# EAGLE design ztsh_autoguide (EAGLE 7.2.0)
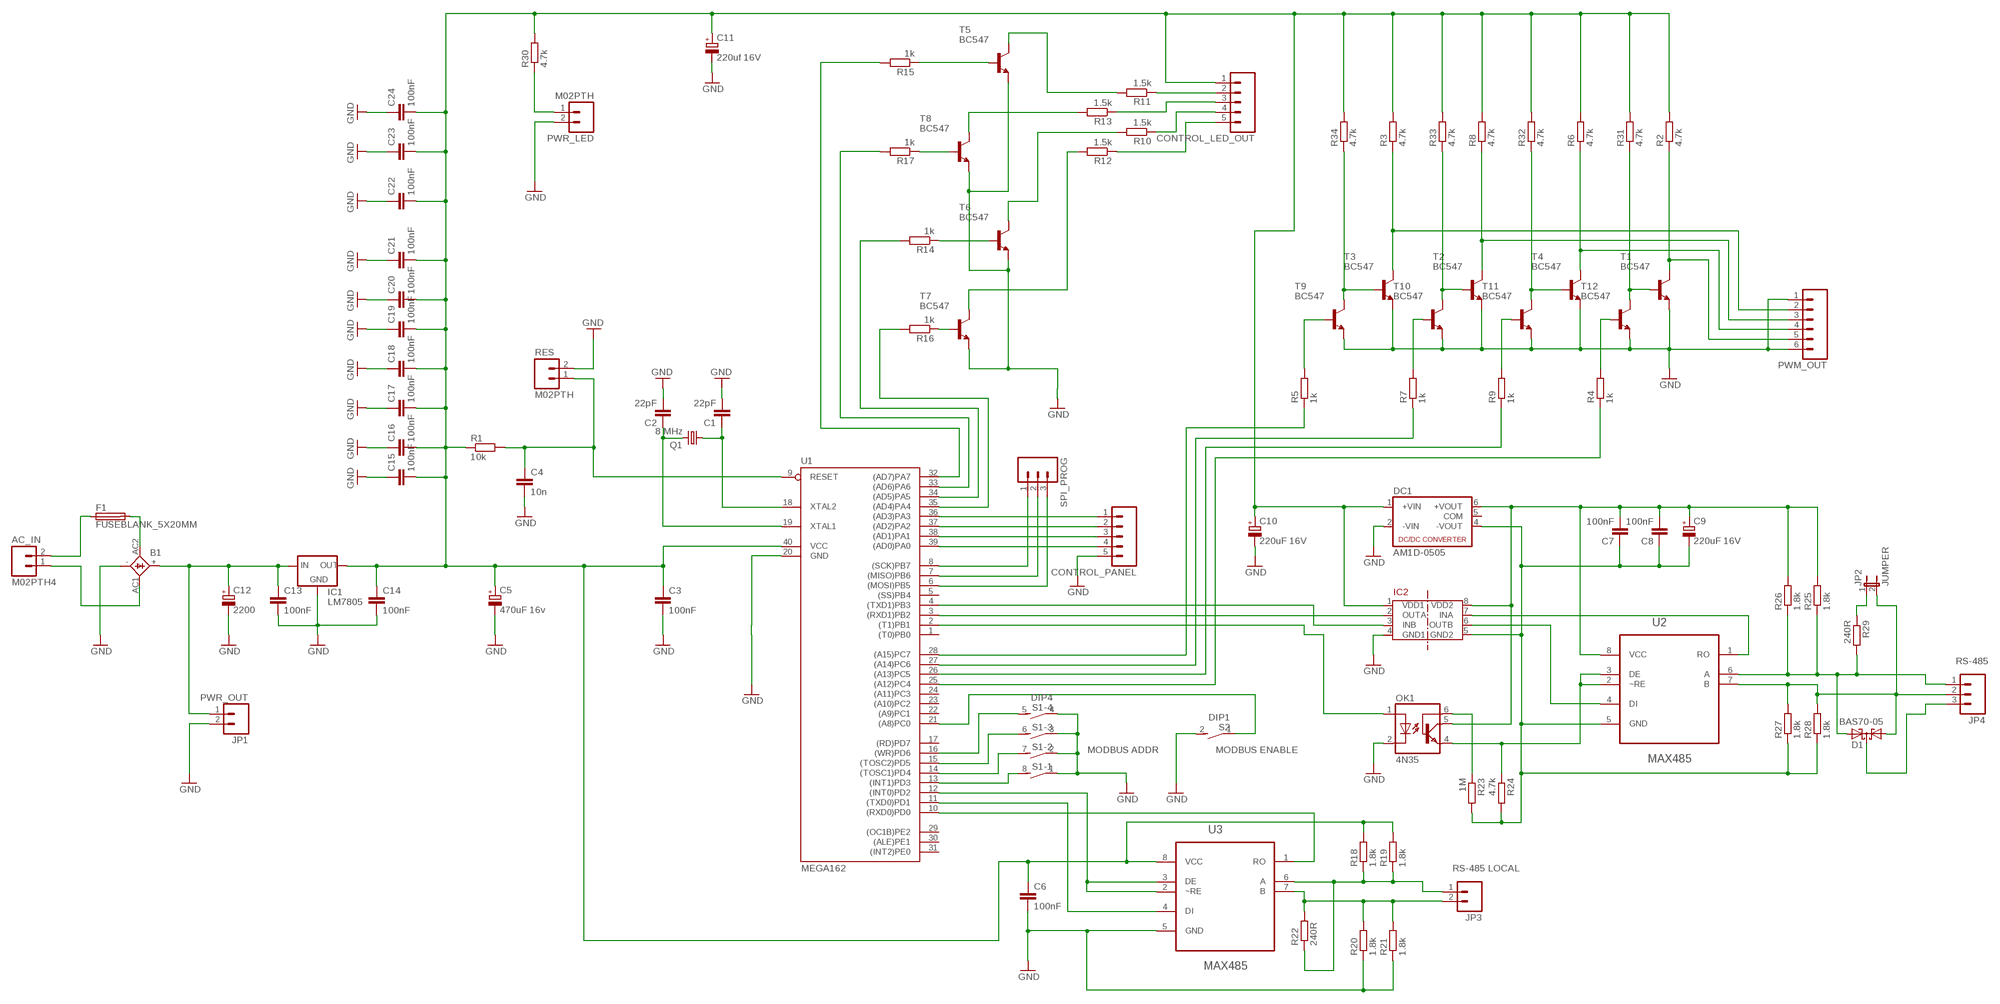
[diagram p0: schematic, sheet 1]

## Parts
AC_IN  M02PTH4  [1X02_XTRA_BIG]
B1  KBL  [KBL]
C1  22pF  C-EU025-024X044  [C025-024X044]
C2  22pF  C-EU025-024X044  [C025-024X044]
C3  100nF  C-EUC0805  [C0805]
C4  10n  C-EUC0805  [C0805]
C5  470uF 16v  CPOL-EUE2-5  [E2-5]
C6  100nF  C-EUC0805  [C0805]
C7  100nF  C-EUC0805  [C0805]
C8  100nF  C-EUC0805  [C0805]
C9  220uF 16V  CPOL-EUE2-5  [E2-5]
C10  220uF 16V  CPOL-EUE2-5  [E2-5]
C11  220uf 16V  CPOL-EUE2-5  [E2-5]
C12  2200  CPOL-EUE3.5-10  [E3,5-10]
C13  100nF  C-EUC0805  [C0805]
C14  100nF  C-EUC0805  [C0805]
C15  100nF  C-EUC0805  [C0805]
C16  100nF  C-EUC0805  [C0805]
C17  100nF  C-EUC0805  [C0805]
C18  100nF  C-EUC0805  [C0805]
C19  100nF  C-EUC0805  [C0805]
C20  100nF  C-EUC0805  [C0805]
C21  100nF  C-EUC0805  [C0805]
C22  100nF  C-EUC0805  [C0805]
C23  100nF  C-EUC0805  [C0805]
C24  100nF  C-EUC0805  [C0805]
CONTROL_LED_OUT  M05LOCK  [1X05_LOCK]
CONTROL_PANEL  M05LOCK  [1X05_LOCK]
D1  BAS70-05  [SOT23]
DC1  AM1D-0505  NMA  [NMA]
F1  FUSEBLANK_5X20MM  [FUSE_HOLDER_5X20MM]
IC1  LM7805  V_REG_78XX-TO-220  [TO-220-ALT]
IC2  ADUM1201  [SO8]
JP1  PWR_OUT  M02LOCK_LONGPADS  [1X02_LOCK_LONGPADS]
JP2  JUMPER  JP1E  [JP1]
JP3  M02JST-PTH-VERT  [JST-2-PTH-VERT]
JP4  M03JST-PTH-VERT  [JST-3-PTH-VERT]
OK1  4N35  [DIL06]
PWM_OUT  M06LOCK  [1X06_LOCK]
PWR_LED  M02PTH  [1X02]
Q1  8 MHz  CRYSTALHC18U-V  [HC18U-V]
R1  10k  R-EU_0207/10  [0207/10]
R2  4.7k  R-EU_0204/7  [0204/7]
R3  4.7k  R-EU_0204/7  [0204/7]
R4  1k  R-EU_0204/7  [0204/7]
R5  1k  R-EU_0204/7  [0204/7]
R6  4.7k  R-EU_0204/7  [0204/7]
R7  1k  R-EU_0204/7  [0204/7]
R8  4.7k  R-EU_0204/7  [0204/7]
R9  1k  R-EU_0204/7  [0204/7]
R10  1.5k  R-EU_0204/7  [0204/7]
R11  1.5k  R-EU_0204/7  [0204/7]
R12  1.5k  R-EU_0204/7  [0204/7]
R13  1.5k  R-EU_0204/7  [0204/7]
R14  1k  R-EU_0204/7  [0204/7]
R15  1k  R-EU_0204/7  [0204/7]
R16  1k  R-EU_0204/7  [0204/7]
R17  1k  R-EU_0204/7  [0204/7]
R18  1.8k  R-EU_R0805  [R0805]
R19  1.8k  R-EU_R0805  [R0805]
R20  1.8k  R-EU_R0805  [R0805]
R21  1.8k  R-EU_R0805  [R0805]
R22  240R  R-EU_R0805  [R0805]
R23  1M  R-EU_0204/7  [0204/7]
R24  4.7k  R-EU_0204/7  [0204/7]
R25  1.8k  R-EU_R0805  [R0805]
R26  1.8k  R-EU_R0805  [R0805]
R27  1.8k  R-EU_R0805  [R0805]
R28  1.8k  R-EU_R0805  [R0805]
R29  240R  R-EU_R0805  [R0805]
R30  4.7k  R-EU_0207/10  [0207/10]
R31  4.7k  R-EU_0204/7  [0204/7]
R32  4.7k  R-EU_0204/7  [0204/7]
R33  4.7k  R-EU_0204/7  [0204/7]
R34  4.7k  R-EU_0204/7  [0204/7]
RES  M02PTH  [1X02]
S1  DIP4  DIP04S  [DIP04S]
S2  DIP1  DS01E  [DS-01]
SPI_PROG  M03LOCK  [1X03_LOCK]
T1  BC547  [TO92]
T2  BC547  [TO92]
T3  BC547  [TO92]
T4  BC547  [TO92]
T5  BC547  [TO92]
T6  BC547  [TO92]
T7  BC547  [TO92]
T8  BC547  [TO92]
T9  BC547  [TO92]
T10  BC547  [TO92]
T11  BC547  [TO92]
T12  BC547  [TO92]
U1  MEGA162  MEGA162PV-*P*  [DIL40]
U2  MAX485  MAX485CSA+  [SOIC127P600X175-8N]
U3  MAX485  MAX485CSA+  [SOIC127P600X175-8N]

## Nets
GND: B1.- C1.2 C2.2 C3.2 C4.2 C5.- C6.2 C10.- C11.- C12.- C13.2 C14.2 C15.1 C16.1 C17.1 C18.1 C19.1 C20.1 C21.1 C22.1 C23.1 C24.1 CONTROL_PANEL.5 DC1.2(-VIN) IC1.GND IC2.4(GND1) JP1.2 OK1.2(C) PWM_OUT.1 PWM_OUT.6 PWR_LED.2 R20.1 R21.1 RES.2 S1.1 S1.2 S1.3 S1.4 S2.2 T1.1(E) T2.1(E) T3.1(E) T4.1(E) T5.1(E) T6.1(E) T7.1(E) T8.1(E) T9.1(E) T10.1(E) T11.1(E) T12.1(E) U1.20(GND) U3.5(GND)
GND_ISOL: C7.1 C8.1 C9.- DC1.4(-VOUT) IC2.5(GND2) R23.2 R24.2 R27.1 R28.1 U2.5(GND)
N$1: C2.1 Q1.2 U1.19(XTAL1)
N$2: C1.1 Q1.1 U1.18(XTAL2)
N$3: C4.1 R1.2 RES.1 U1.9(RESET)
N$4: U1.11((TXD0)PD1) U3.4(DI)
N$5: U1.12((INT0)PD2) U3.2(~RE) U3.3(DE)
N$6: U1.10((RXD0)PD0) U3.1(RO)
N$7: R7.2 T10.2(B)
N$8: R15.2 U1.32((AD7)PA7)
N$9: JP3.1 R18.1 R19.1 R22.1 U3.6(A)
N$10: JP3.2 R20.2 R21.2 R22.2 U3.7(B)
N$11: R17.2 U1.33((AD6)PA6)
N$12: R14.2 U1.34((AD5)PA5)
N$13: R16.1 T7.2(B)
N$14: R16.2 U1.35((AD4)PA4)
N$15: B1.+ C12.+ C13.1 IC1.IN JP1.1
N$16: AC_IN.1 B1.AC1(AC2)
N$17: AC_IN.2 F1.1
N$18: IC2.2(OUTA) U1.3((RXD1)PB2)
N$19: R14.1 T6.2(B)
N$20: CONTROL_LED_OUT.2 R11.1
N$21: CONTROL_LED_OUT.3 R13.1
N$22: CONTROL_LED_OUT.4 R10.1
N$23: CONTROL_LED_OUT.5 R12.1
N$24: R11.2 T5.3(C)
N$25: R13.2 T8.3(C)
N$26: R10.2 T6.3(C)
N$27: R12.2 T7.3(C)
N$28: R17.1 T8.2(B)
N$29: R15.1 T5.2(B)
N$30: B1.AC2(AC1) F1.2
N$31: IC2.3(INB) U1.4((TXD1)PB3)
N$32: R5.2 T9.2(B)
N$33: SPI_PROG.1 U1.8((SCK)PB7)
N$34: SPI_PROG.2 U1.7((MISO)PB6)
N$35: SPI_PROG.3 U1.6((MOSI)PB5)
N$36: IC2.7(INA) U2.1(RO)
N$37: D1.3(C) JP4.3
N$38: IC2.6(OUTB) U2.4(DI)
N$39: R9.2 T11.2(B)
N$40: JP2.1 R29.1
N$41: OK1.4(EMI) R24.1 U2.2(~RE) U2.3(DE)
N$42: CONTROL_PANEL.1 U1.36((AD3)PA3)
N$43: CONTROL_PANEL.2 U1.37((AD2)PA2)
N$44: OK1.1(A) U1.2((T1)PB1)
N$45: D1.2(A2) JP4.1 R25.1 R26.1 R29.2 U2.6(A)
N$46: D1.1(A1) JP2.2 JP4.2 R27.2 R28.2 U2.7(B)
N$47: R4.2 T12.2(B)
N$48: OK1.6(BAS) R23.1
N$49: CONTROL_PANEL.3 U1.38((AD1)PA1)
N$50: CONTROL_PANEL.4 U1.39((AD0)PA0)
N$51: PWR_LED.1 R30.1
N$52: PWM_OUT.5 R2.1 T1.3(C)
N$53: PWM_OUT.4 R6.1 T4.3(C)
N$54: PWM_OUT.3 R8.1 T2.3(C)
N$55: PWM_OUT.2 R3.1 T3.3(C)
N$56: R34.1 T3.2(B) T9.3(C)
N$57: R33.1 T2.2(B) T10.3(C)
N$58: R32.1 T4.2(B) T11.3(C)
N$59: R31.1 T1.2(B) T12.3(C)
N$60: R5.1 U1.28((A15)PC7)
N$61: R7.1 U1.27((A14)PC6)
N$62: R9.1 U1.26((A13)PC5)
N$63: R4.1 U1.25((A12)PC4)
N$64: S1.8 U1.13((INT1)PD3)
N$65: S1.7 U1.14((TOSC1)PD4)
N$66: S1.6 U1.15((TOSC2)PD5)
N$67: S1.5 U1.16((WR)PD6)
N$68: S2.1 U1.21((A8)PC0)
VCC: C3.1 C5.+ C6.1 C10.+ C11.+ C14.1 C15.2 C16.2 C17.2 C18.2 C19.2 C20.2 C21.2 C22.2 C23.2 C24.2 CONTROL_LED_OUT.1 DC1.1(+VIN) IC1.OUT IC2.1(VDD1) R1.1 R2.2 R3.2 R6.2 R8.2 R18.2 R19.2 R30.2 R31.2 R32.2 R33.2 R34.2 U1.40(VCC) U3.8(VCC)
VCC_ISOL: C7.2 C8.2 C9.+ DC1.6(+VOUT) IC2.8(VDD2) OK1.5(COL) R25.2 R26.2 U2.8(VCC)
Unconnected: DC1.5(COM) U1.1((T0)PB0) U1.5((SS)PB4) U1.17((RD)PD7) U1.22((A9)PC1) U1.23((A10)PC2) U1.24((A11)PC3) U1.29((OC1B)PE2) U1.30((ALE)PE1) U1.31((INT2)PE0)

## Notes on the sheet
- RS-485
- MODBUS ADDR | MODBUS ENABLE
- RS-485 LOCAL

## Library data of the parts
AC_IN JP1 JP3 PWR_LED RES = SparkFun-Connectors:M02: Standard 2-pin 0.1" header. Use with - straight break away headers ( PRT-00116) - right angle break away headers (PRT-00553) - swiss pins (PRT-00743) - machine pins (PRT-00117) - female headers (PRT-00115) Molex polarized connector foot print use with: PRT-08233 with associated crimp pins and housings. 2.54_SCREWTERM for use with PRT-10571. 3.5mm Screw Terminal footprints for PRT-08084 5mm Screw Terminal footprints for use with PRT-08433
B1 = rectifier:KBL: DIOTEC RECTIFIER
C1-C4 C6-C8 C13-C24 = rcl:C-EU: CAPACITOR, European symbol
C5 C9-C11 = rcl:CPOL-EU: POLARIZED CAPACITOR, European symbol
C12 = resistor:CPOL-EU: POLARIZED CAPACITOR, European symbol
CONTROL_LED_OUT CONTROL_PANEL = SparkFun-Connectors:M05: Header 5 Standard 5-pin 0.1" header. Use with straight break away headers (SKU : PRT-00116), right angle break away headers (PRT-00553), swiss pins (PRT-00743), machine pins (PRT-00117), and female headers (PRT-00115). Molex polarized connector foot print use with SKU : PRT-08230 with associated crimp pins and housings.
D1 = diode:BAS70-05: Silicon Schottky Diodes General-purpose diode for high-speed switching
DC1 = dc-dc-converter:NMA: DC-DC CONVERTER; MF: C & D TECHNOLOGIES, INC; MPN: NMA0515SC; OC_FARNELL: 1021434; OC_NEWARK: 61K3064
F1 = fuse:FUSE: Fuse; OC_FARNELL: unknown; OC_NEWARK: unknown
IC1 = SparkFun-PowerIC:V_REG_78XX: Voltage Regulator Standard 7805 5V regulator. IGO (Input Ground Output). Spark Fun Electronics SKU : COM-00107
IC2 = Bus-isolators:ADUM1201
JP2 = jumper:JP1E: JUMPER
JP4 SPI_PROG = SparkFun-Connectors:M03: Header 3 Standard 3-pin 0.1" header. Use with straight break away headers (SKU : PRT-00116), right angle break away headers (PRT-00553), swiss pins (PRT-00743), machine pins (PRT-00117), and female headers (PRT-00115). Molex polarized connector foot print use with SKU : PRT-08232 with associated crimp pins and housings.
OK1 = optocoupler:4N35: MOTOROLA OPTO COUPLER; MF: FAIRCHILD SEMICONDUCTOR; MPN: 4N35; OC_FARNELL: 1328375; OC_NEWARK: 72K9946
PWM_OUT = SparkFun-Connectors:M06: Header 6 Standard 6-pin 0.1" header. Use with straight break away headers (SKU : PRT-00116), right angle break away headers (PRT-00553), swiss pins (PRT-00743), machine pins (PRT-00117), and female headers (PRT-00115). Molex polarized connector foot print use with SKU : PRT-08094 with associated crimp pins and housings. NOTES ON THE VARIANTS LOCK and LOCK_LONGPADS... This footprint was designed to help hold the alignment of a through-hole component (i.e. 6-pin header) while soldering it into place. You may notice that each hole has been shifted either up or down by 0.005 of an inch from it's more standard position (which is a perfectly straight line). This slight alteration caused the pins (the squares in the middle) to touch the edges of the holes. Because they are alternating, it causes a "brace" to hold the component in place. 0.005 has proven to be the perfect amount of "off-center" position when using our standard breakaway headers. Although looks a little odd when you look at the bare footprint, once you have a header in there, the alteration is very hard to notice. Also,if you push a header all the way into place, it is covered up entirely on the bottom side. This idea of altering the position of holes to aid alignment will be further integrated into the Sparkfun Library for other footprints. It can help hold any component with 3 or more connection pins.
Q1 = adafruit:CRYSTAL: CRYSTAL; OC_FARNELL: unknown; OC_NEWARK: unknown
R1-R34 = rcl:R-EU_: RESISTOR, European symbol
S1 = switch-dil:DIP04S: DIL/CODE SWITCH; OC_FARNELL: unknown; OC_NEWARK: unknown
S2 = switch-dil:DS01E: DIL/CODE SWITCH; OC_FARNELL: unknown; OC_NEWARK: unknown
T1-T12 = transistor:BC547: NPN TRANSISTOR
U1 = avr-6:MEGA162*P: Amtel Mega162 in a 40 pin DIP package
U2 U3 = Maxim_By_element14_Batch_1:MAX485CSA+: ±15kV ESD-Protected, Slew-Rate-Limited, Low-Power, RS-485/RS-422 Transceivers; MPN: MAX485CSA+; OC_FARNELL: 9725954; OC_NEWARK: 68K4795; PACKAGE: SOIC-8; SUPPLIER: Maxim

## Board
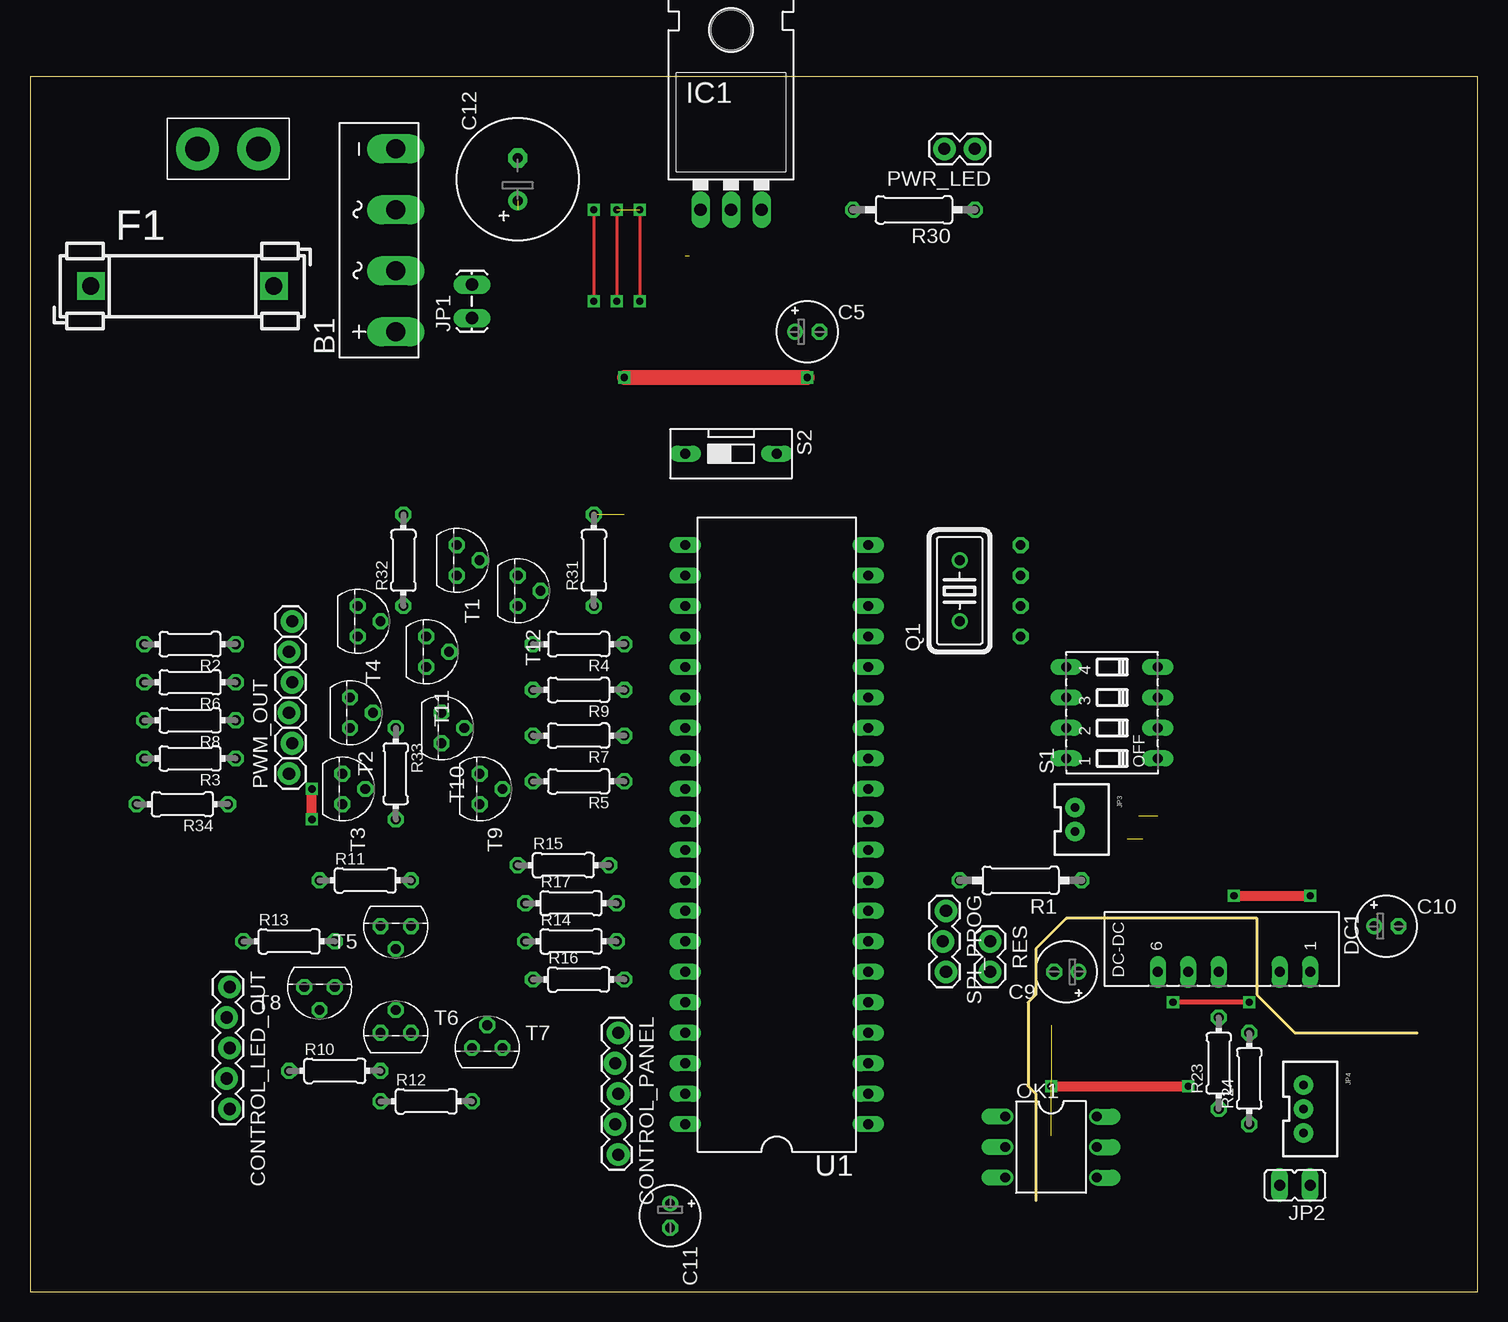
[diagram p1: board, top side]
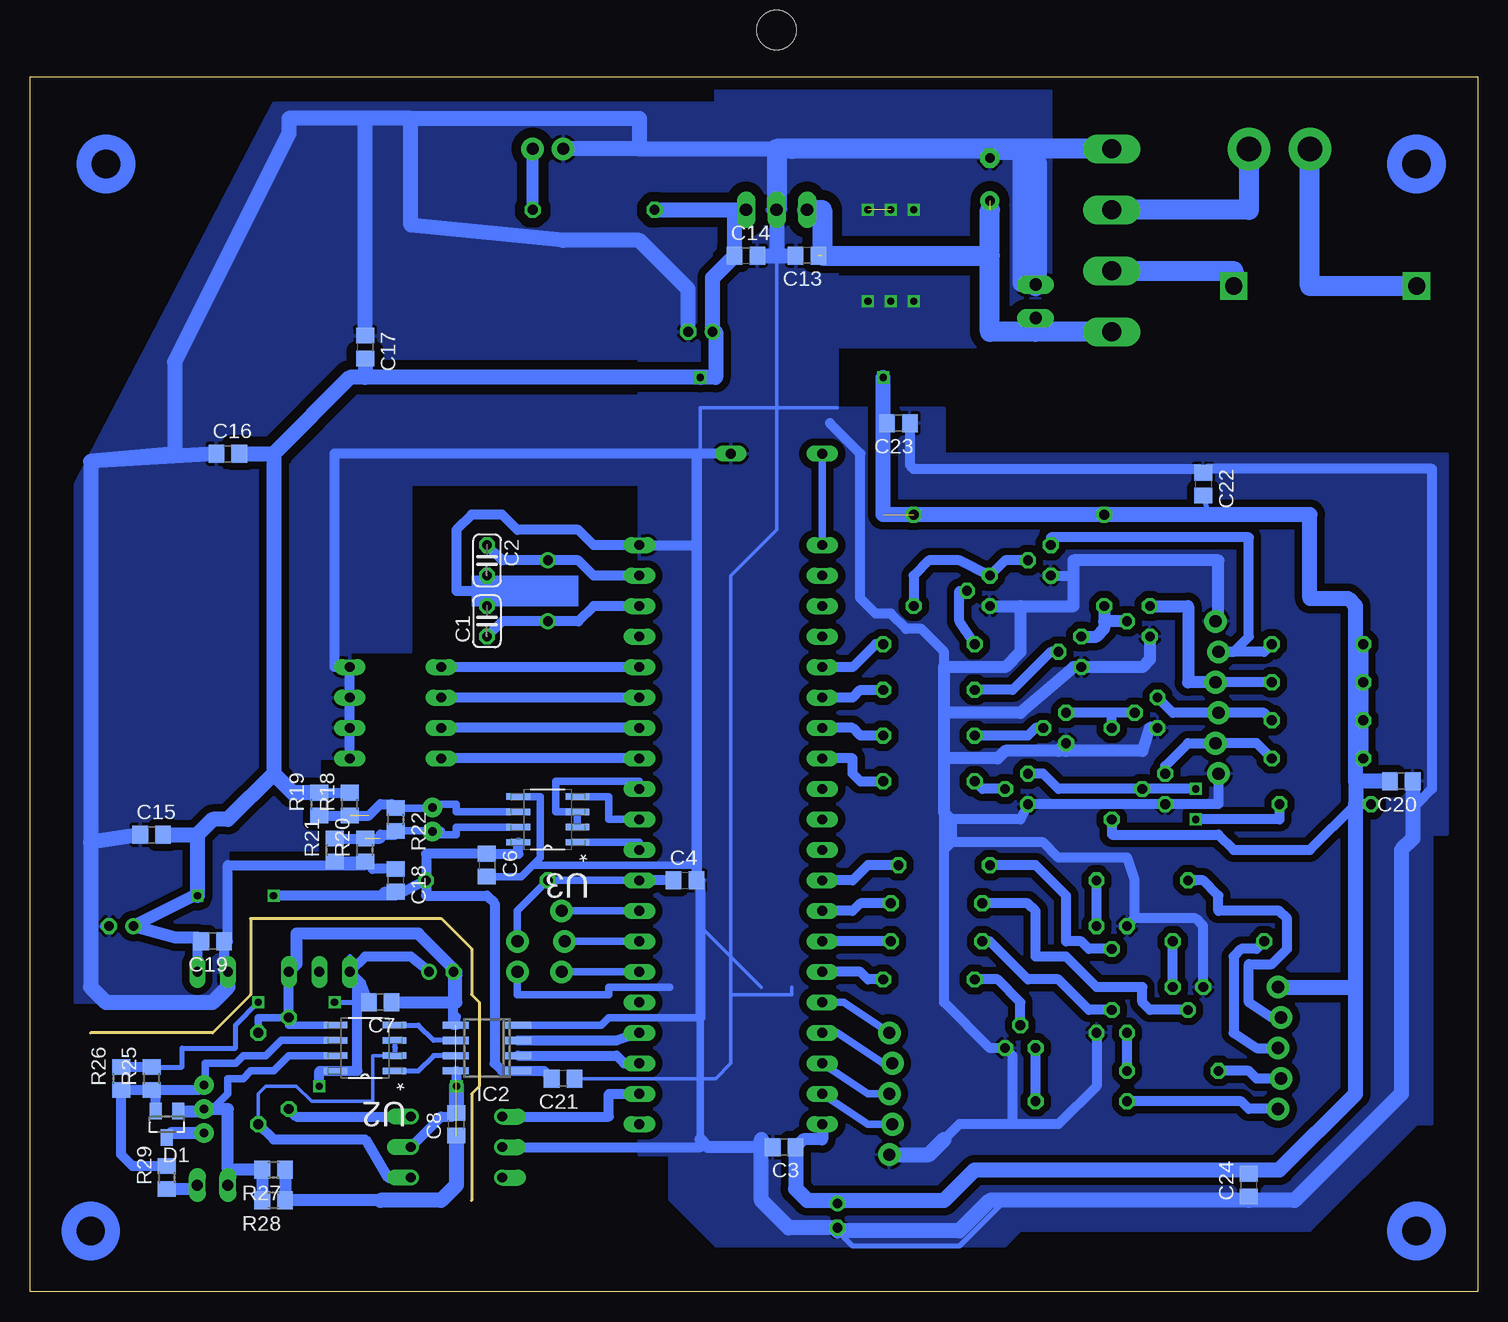
[diagram p2: board, bottom side, seen from below]

Size 120.63 x 101.27 mm. Coordinates in mm from the lower left corner, seen from the top.
Outline: 115.57,21.59 105.41,21.59 102.23,24.77 102.23,31.11 86.36,31.11 83.82,28.57 83.82,24.77 83.19,24.13 83.19,17.14 83.82,16.51 83.82,7.62
Outline: 0,0 120.63,0 120.63,101.27 0,101.27 0,0
Copper layers (1*16): Top 0.035mm / dielectric 1.5mm / Bottom 0.035mm
Design rules "default": minimum track width 10mil, minimum drill 24mil, track to track 8mil, track to pad 8mil, pad to pad 8mil, via to via 8mil, smd to smd 8mil, copper to edge 40mil, drill to drill 8mil, minimum pad ring 10mil, minimum via ring 8mil, stop-mask expansion 4mil, vias tented up to drill 0mil, thermal gap 10mil

### Footprints (pad centres in the part's own frame; a part is rotated, then mirrored left to right if it is on the bottom)
1X02_XTRA_BIG = drill 2.057 pad 3.556: 1 -2.54,0; 2 2.54,0
KBL = drill 1.6 long: + -7.62,-1.27; - 7.62,-1.27; AC1 2.54,-1.27; AC2 -2.54,-1.27
C025-024X044 = drill 0.813 octagon: 1 -1.27,0; 2 1.27,0
C0805 = smd 1.3 x 1.5: 1 -0.95,0; 2 0.95,0
E2-5 = drill 0.813 pad 1.27: + -1.016,0 | drill 0.813 pad 1.27 octagon: - 1.016,0
E3,5-10 = drill 0.813 pad 1.6: + -1.778,0 | drill 0.813 pad 1.6 octagon: - 1.778,0
1X05_LOCK = drill 1.016 pad 1.88: 1 0,0.127; 2 2.54,-0.127; 3 5.08,0.127; 4 7.62,-0.127; 5 10.16,0.127
SOT23 = smd 1 x 1.4: 1 -0.95,-1.1; 2 0.95,-1.1; 3 0,1.1
NMA = drill 0.813 long: 1 0,6.35; 2 0,3.81; 4 0,-1.27; 5 0,-3.81; 6 0,-6.35
FUSE_HOLDER_5X20MM = drill 1.422 pad 2.286 square: 1 0,0; 2 15.24,0
TO-220-ALT = drill 1.016 long: GND 0,-3.81; IN -2.54,-3.81; OUT 2.54,-3.81 | hole 3.302: 0,11.176
SO8 = smd 0.6 x 2.2: 1 -1.905,-2.6; 2 -0.635,-2.6; 3 0.635,-2.6; 4 1.905,-2.6; 5 1.905,2.6; 6 0.635,2.6; 7 -0.635,2.6; 8 -1.905,2.6
1X02_LOCK_LONGPADS = drill 1.016 long: 1 -0.127,0; 2 2.667,0
JP1 = drill 0.914 long: 1 0,-1.27; 2 0,1.27
JST-2-PTH-VERT = drill 0.7 pad 1.626: 1 -1,-0.55; 2 1,-0.55
JST-3-PTH-VERT = drill 0.7 pad 1.626: 1 -2,-0.55; 2 0,-0.55; 3 2,-0.55
DIL06 = drill 0.813 offset: 1 -2.54,-3.81; 2 0,-3.81; 3 2.54,-3.81; 4 2.54,3.81; 5 0,3.81; 6 -2.54,3.81
1X06_LOCK = drill 1.016 pad 1.88: 1 0,0; 2 2.54,-0.254; 3 5.08,0; 4 7.62,-0.254; 5 10.16,0; 6 12.7,-0.254
1X02 = drill 1.016 pad 1.88: 1 0,0; 2 2.54,0
HC18U-V = drill 0.813: 1 -2.54,0; 2 2.54,0
0207/10 = drill 0.813 octagon: 1 -5.08,0; 2 5.08,0
0204/7 = drill 0.813 octagon: 1 -3.81,0; 2 3.81,0
R0805 = smd 1.3 x 1.5: 1 -0.95,0; 2 0.95,0
DIP04S = drill 0.813 long: 1 -3.81,-3.81; 2 -1.27,-3.81; 3 1.27,-3.81; 4 3.81,-3.81; 5 3.81,3.81; 6 1.27,3.81; 7 -1.27,3.81; 8 -3.81,3.81
DS-01 = drill 0.813 long: 1 0,-3.81; 2 0,3.81
1X03_LOCK = drill 1.016 pad 1.88: 1 0,0.127; 2 2.54,-0.127; 3 5.08,0.127
TO92 = drill 0.813 octagon: 1 1.27,0; 2 0,1.905; 3 -1.27,0
DIL40 = drill 0.813 long: 1 -24.13,-7.62; 2 -21.59,-7.62; 3 -19.05,-7.62; 4 -16.51,-7.62; 5 -13.97,-7.62; 6 -11.43,-7.62; 7 -8.89,-7.62; 8 -6.35,-7.62; 9 -3.81,-7.62; 10 -1.27,-7.62; 11 1.27,-7.62; 12 3.81,-7.62; 13 6.35,-7.62; 14 8.89,-7.62; 15 11.43,-7.62; 16 13.97,-7.62; 17 16.51,-7.62; 18 19.05,-7.62; 19 21.59,-7.62; 20 24.13,-7.62; 21 24.13,7.62; 22 21.59,7.62; 23 19.05,7.62; 24 16.51,7.62; 25 13.97,7.62; 26 11.43,7.62; 27 8.89,7.62; 28 6.35,7.62; 29 3.81,7.62; 30 1.27,7.62; 31 -1.27,7.62; 32 -3.81,7.62; 33 -6.35,7.62; 34 -8.89,7.62; 35 -11.43,7.62; 36 -13.97,7.62; 37 -16.51,7.62; 38 -19.05,7.62; 39 -21.59,7.62; 40 -24.13,7.62
SOIC127P600X175-8N = smd 1.981 x 0.533: 1 -2.464,1.905; 2 -2.464,0.635; 3 -2.464,-0.635; 4 -2.464,-1.905; 5 2.464,-1.905; 6 2.464,-0.635; 7 2.464,0.635; 8 2.464,1.905

### Placement (x,y rotation side)
AC_IN  16.51,95.25 180 top
B1  29.21,87.63 90 top
C1  82.55,55.88 90 bottom
C2  82.55,60.96 270 bottom
C3  57.79,12.06 180 bottom
C4  66.04,34.29 0 bottom
C5  64.77,80.01 0 top
C6  82.55,35.56 270 bottom
C7  91.44,24.13 180 bottom
C8  85.09,13.97 90 bottom
C9  86.36,26.67 180 top
C10  113.03,30.48 0 top
C11  53.34,6.35 270 top
C12  40.64,92.71 90 top
C13  55.88,86.36 180 bottom
C14  60.96,86.36 0 bottom
C15  110.49,38.1 0 bottom
C16  104.14,69.85 0 bottom
C17  92.71,78.74 270 bottom
C18  90.17,34.29 270 bottom
C19  105.41,29.21 180 bottom
C20  6.35,42.55 180 bottom
C21  76.2,17.78 180 bottom
C22  22.86,67.31 270 bottom
C23  48.26,72.39 180 bottom
C24  19.05,8.89 90 bottom
CONTROL_LED_OUT  16.51,25.4 270 top
CONTROL_PANEL  48.9,21.59 270 top
D1  109.22,13.97 180 bottom
DC1  100.33,26.67 270 top
F1  5.08,83.82 0 top
IC1  58.42,93.98 0 top
IC2  82.55,20.32 90 bottom
JP1  36.83,81.28 90 top
JP2  105.41,8.89 90 top
JP3  87.63,39.37 270 top
JP4  106.68,15.24 270 top
OK1  85.09,12.06 270 top
PWM_OUT  21.59,43.18 90 top
PWR_LED  78.74,95.25 180 top
Q1  77.47,58.42 90 top
R1  82.55,34.29 180 top
R2  13.33,53.98 180 top
R3  13.33,44.45 180 top
R4  45.72,53.98 180 top
R5  45.72,42.55 180 top
R6  13.33,50.8 180 top
R7  45.72,46.35 180 top
R8  13.33,47.62 180 top
R9  45.72,50.16 180 top
R10  25.4,18.41 0 top
R11  27.94,34.29 0 top
R12  33.02,15.88 0 top
R13  21.59,29.21 0 top
R14  45.09,29.21 0 top
R15  44.45,35.56 0 top
R16  45.72,26.04 0 top
R17  45.09,32.38 0 top
R18  93.98,40.64 90 bottom
R19  96.52,40.64 90 bottom
R20  92.71,36.83 90 bottom
R21  95.25,36.83 90 bottom
R22  90.17,39.37 270 bottom
R23  99.06,19.05 90 top
R24  101.6,17.78 90 top
R25  110.49,17.78 90 bottom
R26  113.03,17.78 90 bottom
R27  100.33,10.16 180 bottom
R28  100.33,7.62 180 bottom
R29  109.22,9.53 90 bottom
R30  73.66,90.17 180 top
R31  46.99,60.96 90 top
R32  31.11,60.96 90 top
R33  30.48,43.18 270 top
R34  12.7,40.64 180 top
RES  80.01,29.21 270 top
S1  90.17,48.26 90 top
S2  58.42,69.85 270 top
SPI_PROG  76.2,31.75 270 top
T1  35.56,60.96 270 top
T2  26.67,48.26 270 top
T3  26.04,41.91 270 top
T4  27.3,55.88 270 top
T5  30.48,30.48 180 top
T6  30.48,21.59 0 top
T7  38.1,20.32 0 top
T8  24.13,25.4 180 top
T9  37.47,41.91 270 top
T10  34.29,46.99 270 top
T11  33.02,53.34 270 top
T12  40.64,58.42 270 top
U1  62.23,38.1 90 top
U2  92.71,20.32 180 bottom
U3  77.47,39.37 180 bottom

### Tracks (layer width: path | path; a pad name or v marks a point on that pad's centre or on a via)
GND  (via drill 0.6)  (1 unrouted)
  Top 0.254: v46.99,90.17 v46.99,82.55 | v48.9,90.17 v48.9,82.55 | v50.8,90.17 v50.8,82.55
  Bottom 0.305: C21.1 63.5,17.78 62.23,19.05 62.23,24.77 | 62.23,24.77 62.23,59.69 58.42,63.5 IC1.GND | C12.- 37.34,94.49 36.83,93.98 | 62.23,24.77 57.15,24.77 57.15,25.4 | 53.34,73.66 64.77,73.66 64.77,30.48 59.69,25.4
  Bottom 0.406: 19.05,7.62 C24.1 39.05,7.94 43.18,3.81 52.07,3.81 53.34,5.08
  Bottom 0.61: U3.5 78.1,41.27 78.1,36.2 78.74,35.56 | C6.2 79.69,34.61 78.74,35.56 | 78.74,35.56 65.09,35.56 | 64.77,12.7 64.77,22.86 72.39,22.86 73.02,22.23 IC2.4 | RES.2 80.01,24.77 72.39,24.77 72.39,25.4 67.31,25.4
  Bottom 0.813: C1.2 82.55,58.42 | 82.55,58.42 C2.2 | 82.55,58.42 85.09,58.42 85.09,63.5 83.82,64.77 81.28,64.77 80.01,63.5 74.93,63.5 73.66,62.23 U1.20 65.09,62.23 | 65.09,62.23 65.09,35.56 C4.2 64.77,34.29 64.77,22.86 | 65.09,62.23 65.09,69.85 S2.2 95.25,69.85 95.25,52.07 S1.4 S1.1 | R21.1 R20.1 | OK1.2 64.77,12.06 64.77,12.7 | DC1.2 104.46,26.67 C19.1 104.14,29.21 104.14,35.56 92.71,35.56 R20.1 | C18.1 92.07,35.24 R20.1 | 28.57,31.11 T5.1 | T6.1 31.75,17.14 34.93,13.97 38.73,13.97 | T8.1 22.86,30.48 23.49,31.11 28.57,31.11 | 28.57,31.11 28.57,34.29 29.21,36.2 34.93,36.2 36.2,37.47 43.82,37.47 | 38.73,13.97 43.18,13.97 44.45,12.7 | 5.08,40.64 3.81,41.91 3.81,68.58 22.54,68.58 C22.1 23.18,68.58 46.99,68.58 47.31,68.9 C23.1 | 21.59,56.13 PWM_OUT.6 | PWM_OUT.1 21.59,40.64 T3.1 T9.1 38.1,39.37 43.82,39.37 | 43.82,39.37 44.45,40.01 | 43.82,39.37 43.82,37.47 | 43.82,37.47 44.45,36.83 | 38.73,13.97 38.73,19.68 T7.1 40.64,20.32 44.45,24.13 44.45,36.83 | 44.45,36.83 44.45,53.34 46.36,55.24 47.62,55.24 48.9,56.52 50.16,56.52 51.44,57.78 51.44,69.85 53.98,72.39 | T1.1 33.66,59.69
  Bottom 1.016: C3.2 64.13,12.06 64.77,12.7 | C10.- 114.3,30.48 | 44.45,40.01 44.45,44.45 | 44.45,44.45 44.45,48.26 | 44.45,48.26 44.45,52.07 39.37,52.07 38.1,53.34 38.1,57.15 | 21.59,56.13 21.59,60.96 33.66,60.96 33.66,59.69 33.66,57.15 38.1,57.15 | T12.1 38.1,57.15 | T4.1 27.3,52.7 27.94,52.07 T11.1 33.66,52.07 38.1,48.26 44.45,48.26 | T2.1 27.3,46.99 27.94,45.09 34.29,45.09 | 34.93,45.09 T10.1 34.29,45.09 | 34.29,45.09 34.93,45.09 | 34.93,45.09 39.37,45.09 40.01,44.45 44.45,44.45
  Bottom 1.27: 69.85,95.25 57.15,95.25 | C14.2 58.42,86.36 | 58.42,86.36 C13.2 | IC1.GND 58.42,86.36 | C5.- 65.79,83.57 69.85,87.63 76.2,87.63 88.9,88.9 88.9,97.79 | 88.9,97.79 69.85,97.79 69.85,95.25 | 69.85,95.25 PWR_LED.2 | 88.9,97.79 92.71,97.79 | 92.71,97.79 99.06,97.79 99.06,96.52 108.58,77.47 108.58,69.85 115.57,69.22 | 115.57,69.22 115.57,37.47 | 115.57,37.47 115.57,25.4 114.3,24.13 105.41,24.13 104.14,25.4 DC1.2 | C15.1 115.57,37.47 | C16.1 115.57,69.22 | C17.1 92.71,97.79 | JP1.2 38.1,83.95 38.1,95.25 | C11.- 57.4,5.33 59.69,7.62 59.69,12.7 | C20.1 5.4,37.78 6.35,36.83 6.35,16.51 15.24,7.62 19.05,7.62 40.64,7.62 43.18,5.08 53.34,5.08 | CONTROL_PANEL.5 45.72,11.43 44.45,12.7
  Bottom 1.676: B1.- 38.1,95.25 40.64,95.25 | C12.- 40.64,95.25 | 40.64,95.25 57.15,95.25 58.42,95.25 IC1.GND
  Bottom 1.93: JP1.2 36.83,93.98
  pour Bottom (isolate 0.813): 63.5,99.06 100.33,99.06 116.84,67.31 62.23,67.31 62.23,97.79
  pour Bottom (isolate 0.61): 54.61,86.36 69.85,86.36 69.85,11.43 53.34,11.43 53.34,86.36
  pour Bottom (isolate 0.813): 35.56,100.33 63.5,100.33 63.5,78.74 35.56,78.74 35.56,99.06
  pour Bottom (isolate 0.61): 88.9,69.85 116.84,67.31 116.84,24.13 104.14,24.13 104.14,36.83 96.52,36.83 96.52,44.45 93.98,44.45 93.98,53.34 88.9,53.34
  pour Bottom (isolate 0.61): 46.99,73.66 44.45,73.66 44.45,69.85 2.54,69.85 2.54,38.1 3.81,38.1 3.81,13.97 5.08,13.97 13.97,5.08 38.1,5.08 39.37,3.81 63.5,3.81 67.31,7.62 67.31,73.66 48.26,73.66
GND_ISOL  (1 unrouted)
  Bottom 0.61: U2.5 99.06,22.23 R23.2 101.6,22.86 R24.2
  Bottom 0.813: 85.15,22.92 IC2.5 85.34,22.23 C9.- | R23.2 DC1.4
  Bottom 1.016: R27.1 R28.1 91.44,7.62 | 85.09,26.42 C9.- | C7.1 85.09,24.13 85.09,26.42 | 85.09,26.42 85.09,26.67 88.27,29.84 98.42,29.84 98.42,27.3 DC1.4
  Bottom 1.27: C8.1 85.09,8.89 86.36,7.62 91.44,7.62
N$1
  Bottom 0.813: U1.19 73.66,59.69 74.93,60.96 Q1.2 81.28,60.96 C2.1
N$2
  Bottom 0.813: U1.18 73.66,57.15 74.93,55.88 Q1.1 81.28,55.88 C1.1
N$3
  Bottom 0.61: U1.9 R1.2 80.01,31.75 RES.1
  Bottom 0.813: C4.1 U1.9
N$4
  Bottom 0.61: U3.4 72.39,41.27 72.39,39.37 U1.11
N$5
  Bottom 0.61: U3.2 U3.3 76.83,40.01 76.83,42.55 69.85,42.55 U1.12
N$6
  Bottom 0.61: U3.1 69.85,37.47 U1.10
N$7
  Bottom 0.813: T10.2 36.83,46.99 37.47,46.35 R7.2
N$8
  Bottom 0.813: R15.2 50.8,35.56 52.07,34.29 U1.32
N$9  (1 unrouted)
  Bottom 0.61: U3.6 85.09,40.01 85.09,40.64 87.08,40.64 JP3.1 87.08,40.32 R22.1
  Bottom 0.813: R19.1 92.39,39.69 91.44,40.64 90.49,40.64 R22.1
N$10  (1 unrouted)
  Bottom 0.61: U3.7 85.09,38.73 85.09,38.1 86.36,38.1 | 86.36,38.1 87.08,38.1 JP3.2 | R22.2 86.36,38.42 86.36,38.1
  Bottom 0.813: R21.2 91.44,37.78 91.44,38.1 90.17,38.1 R22.2
N$11
  Bottom 0.813: R17.2 51.44,32.38 52.07,31.75 U1.33
N$12
  Bottom 0.813: R14.2 U1.34
N$13
  Bottom 0.813: T7.2 38.1,24.13 40.01,26.04 R16.1
N$14
  Bottom 0.813: R16.2 50.8,26.04 51.44,26.67 U1.35
N$15  (2 unrouted)
  Bottom 1.016: JP1.1 36.83,80.01
  Bottom 1.676: B1.+ 36.83,80.01 40.64,80.01 40.64,86.36 | 40.64,86.36 40.64,90.17 | IC1.IN 54.61,90.17 54.61,86.36 40.64,86.36
N$16
  Bottom 1.676: AC_IN.1 19.05,90.17 B1.AC1
N$17
  Bottom 1.676: F1.1 13.97,83.82 AC_IN.2
N$18
  Bottom 0.813: IC2.2 71.75,19.68 71.12,19.05 U1.3
N$19
  Bottom 0.813: T6.2 32.39,23.5 34.93,26.04 37.47,26.04 40.64,29.21 R14.1
N$20
  Bottom 0.813: CONTROL_LED_OUT.2 17.14,22.86 19.05,24.13 19.05,27.3 17.14,27.3 15.88,28.57 15.88,31.11 16.51,31.75 21.59,31.75 21.59,33.02 22.86,34.29 23.49,34.29 R11.1
N$21
  Bottom 0.813: R13.1 18.41,28.57 19.68,28.57 20.32,27.94 20.32,21.59 18.41,20.32 CONTROL_LED_OUT.3
N$22
  Bottom 0.813: CONTROL_LED_OUT.4 18.41,17.78 19.05,18.41 R10.1
N$23
  Bottom 0.813: CONTROL_LED_OUT.5 19.05,15.24 19.68,15.88 R12.1
N$24
  Bottom 0.813: T5.3 R11.2
N$25
  Bottom 0.813: T8.3 R13.2
N$26
  Bottom 0.813: R10.2 T6.3
N$27
  Bottom 0.813: R12.2 T7.3
N$28
  Bottom 0.813: R17.1 37.47,32.38 36.83,31.75 36.83,27.94 34.29,27.94 31.75,25.4 27.94,25.4 27.94,24.13 27.3,23.5 T8.2
N$29
  Bottom 0.813: R15.1 36.83,35.56 34.29,33.02 34.29,29.21 33.02,29.21 32.39,28.57 T5.2
N$30
  Bottom 1.676: B1.AC2 20.32,85.09 F1.2
N$31
  Bottom 0.813: IC2.3 71.75,20.95 U1.4
N$32
  Bottom 0.813: T9.2 41.28,41.91 R5.2
N$33
  Bottom 0.61: SPI_PROG.1 U1.8
N$34
  Bottom 0.61: SPI_PROG.2 U1.7
N$35
  Bottom 0.61: SPI_PROG.3 U1.6
N$36
  Bottom 0.406: IC2.7 86.99,19.68 88.27,18.41 U2.1
N$37
  Bottom 0.305: 108.85,13.24 D1.3
  Bottom 1.016: 108.85,13.24 JP4.3
N$38
  Bottom 0.406: IC2.6 86.99,20.95 88.27,22.23 U2.4
N$39
  Bottom 0.813: T11.2 35.56,53.34 38.73,50.16 R9.2
N$40
  Bottom 1.016: R29.1 106.68,8.57 JP2.1
N$41
  Bottom 0.305: U2.2 92.07,19.68 92.07,15.88 97.16,15.88 98.42,17.14 100.96,17.14 101.6,16.51 R24.1
  Bottom 0.406: U2.2 U2.3 90.25,20.4 90.17,20.32
  Bottom 0.813: R24.1 100.33,12.7 92.71,12.7 90.8,9.53 OK1.4
N$42
  Bottom 0.61: U1.36 52.83,24.13 CONTROL_PANEL.1
N$43
  Bottom 0.61: U1.37 53.34,21.59 49.53,19.05 CONTROL_PANEL.2
N$44
  Bottom 0.813: OK1.1 72.39,14.61 72.39,16.51 U1.2
N$45
  Bottom 0.61: U2.6 99.69,20.95 100.96,19.68 102.87,19.68 103.5,19.05 106.05,19.05 106.05,17.32 JP4.1
  Bottom 0.813: R29.2 112.07,10.47 113.03,11.43 R26.1 R25.1 | D1.2 110.17,16.51 R25.1 | R25.1 106.54,16.83 JP4.1
N$46
  Bottom 0.61: U2.7 99.06,19.68 100.33,18.41 102.23,18.41 102.87,17.78 104.14,17.78 104.14,16.51 105.41,15.24
  Bottom 1.016: R28.2 R27.2 104.14,10.16 | 104.14,10.16 JP2.2 | 104.14,10.16 104.14,15.24 105.41,15.24 JP4.2 106.13,15.07 D1.1
N$47
  Bottom 0.813: R4.2 43.18,55.88 43.18,58.42 T12.2
N$48
  Bottom 0.813: R23.1 98.42,14.61 OK1.6
N$49
  Bottom 0.61: U1.38 50.8,16.51 CONTROL_PANEL.3
N$50
  Bottom 0.61: CONTROL_PANEL.4 50.8,13.97 U1.39
N$51
  Bottom 1.016: R30.1 PWR_LED.1
N$52
  Bottom 0.813: T1.3 35.56,62.87 19.05,62.87 19.05,54.61 20.32,53.34 PWM_OUT.5 17.78,53.34 R2.1
N$53
  Bottom 0.305: PWM_OUT.4 21.59,50.8
  Bottom 0.813: R6.1 PWM_OUT.4
  Bottom 1.016: PWM_OUT.4 24.13,50.8 24.13,57.15 T4.3
N$54
  Bottom 0.813: R8.1 17.78,48.26 PWM_OUT.3 25.4,48.26 T2.3
N$55
  Bottom 0.813: R3.1 18.41,45.72 PWM_OUT.2 24.13,45.72 26.04,43.81 T3.3
N$56  (via drill 0.6)
  Top 0.813: v23.49,39.37 v23.49,41.91
  Bottom 0.813: T9.3 36.2,43.18 34.93,41.91 T3.2 v23.49,41.91 | R34.1 16.51,39.37 v23.49,39.37
N$57
  Bottom 0.813: T2.2 30.48,48.26 | 30.48,48.26 T10.3 | R33.1 30.48,48.26
N$58
  Bottom 1.016: R32.1 31.11,55.88 | 31.11,55.88 31.11,55.24 31.75,54.61 T11.3 | T4.2 31.11,55.88
N$59
  Bottom 0.813: R31.1 46.99,59.69 45.72,60.96 43.18,60.96 T12.3 39.37,60.96 T1.2
N$60
  Bottom 0.813: U1.28 52.07,44.45 52.07,43.18 51.44,42.55 R5.1
N$61
  Bottom 0.813: U1.27 52.07,46.99 51.44,46.35 R7.1
N$62
  Bottom 0.813: U1.26 52.07,49.53 51.44,50.16 R9.1
N$63
  Bottom 0.813: U1.25 52.07,52.07 50.16,53.98 R4.1
N$64
  Bottom 0.813: U1.13 S1.8
N$65
  Bottom 0.813: U1.14 S1.7
N$66
  Bottom 0.813: U1.15 S1.6
N$67
  Bottom 0.813: U1.16 S1.5
N$68
  Bottom 0.61: S2.1 U1.21
VCC  (via drill 0.6)  (1 unrouted)
  Top 0.813: v100.33,33.02 v106.68,33.02
  Top 1.27: v49.53,76.2 v64.77,76.2
  Bottom 0.406: C22.2 22.54,65.09 24.13,64.77 | C23.2 49.21,73.34 49.53,73.66 | C24.2 19.05,10.16
  Bottom 0.813: R19.2 R18.2 | U3.8 79.93,36.51 C6.1 87.63,36.51 R1.1 | DC1.1 106.68,29.21 C19.2 106.68,29.53 | R1.1 90.17,33.02 91.44,33.02 | 91.44,33.02 v100.33,33.02 | C18.2 91.12,33.34 91.44,33.02 | R1.1 87.63,33.02 82.55,33.02 81.91,32.38 81.91,19.05 81.28,18.41 IC2.1 | R2.2 R6.2 R8.2 R3.2 10.16,43.81 10.16,42.55 | IC2.1 79.38,18.41 | IC2.1 77.78,18.41 C21.2 | R33.2 30.48,38.1 21.59,38.1 20.32,36.83 13.97,36.83 10.16,40.64 R34.2
  Bottom 1.016: U1.40 54.61,12.7 56.2,12.7 C3.1 | v106.68,33.02 106.93,33.02 C10.+ 108.52,29.53 106.68,29.53
  Bottom 1.27: R30.2 62.23,90.17 | 62.23,90.17 IC1.OUT | 62.23,90.17 61.91,89.85 C14.1 63.75,84.52 C5.+ 63.5,80.01 63.5,76.2 v64.77,76.2 92.71,76.2 | 92.71,76.2 93.98,76.2 100.33,69.85 | 100.33,69.85 100.33,43.18 | 100.33,43.18 104.14,39.37 105.41,39.37 106.68,38.1 | 106.68,38.1 v106.68,33.02 | R19.2 98.74,41.59 100.33,43.18 | C15.2 106.68,38.1 | C16.2 100.33,69.85 | C17.2 92.71,76.2 | v49.53,76.2 49.53,73.66 49.53,64.77 R32.2 24.13,64.77 13.97,64.77 13.97,57.78 10.79,57.78 10.16,57.15 10.16,42.55 | C3.1 56.84,8.57 55.88,7.62 53.34,7.62 | 53.34,7.62 44.45,7.62 41.91,10.16 19.05,10.16 16.51,10.16 10.16,16.51 10.16,25.4 | 10.16,25.4 10.16,40.64 10.16,42.55 | C11.+ 53.34,7.62 | CONTROL_LED_OUT.1 10.16,25.4 | C20.2 10.16,42.55
VCC_ISOL  (via drill 0.6)
  Top 0.406: v101.6,24.13 v95.25,24.13
  Top 0.813: v85.09,17.14 v96.52,17.14
  Bottom 0.406: R25.2 107.95,18.73 107.95,20.32 103.5,20.32 103.5,22.23 v101.6,24.13 | DC1.6 93.98,27.94 | v95.25,24.13 93.34,24.13
  Bottom 0.813: IC2.8 85.09,18.41 v85.09,17.14 | v96.52,17.14 96.52,18.41 U2.8 93.34,18.41 93.34,24.13 93.34,26.04 DC1.6 | C9.+ 88.9,27.94 92.71,27.94 DC1.6 | R25.2 R26.2 | C7.2 93.03,25.72 DC1.6 | OK1.5 86.36,14.61 85.41,14.61 C8.2
  Bottom 1.27: v85.09,17.14 C8.2
(copper drawn outside any net)
  shapes: Bottom area x1, Bottom circle x4